# EAGLE design lixie_digit_maxi (EAGLE 7.6.0)
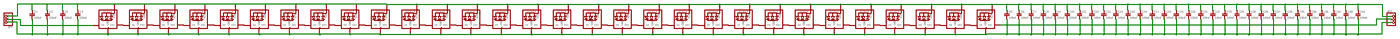
[diagram p0: schematic, sheet 1, overview]
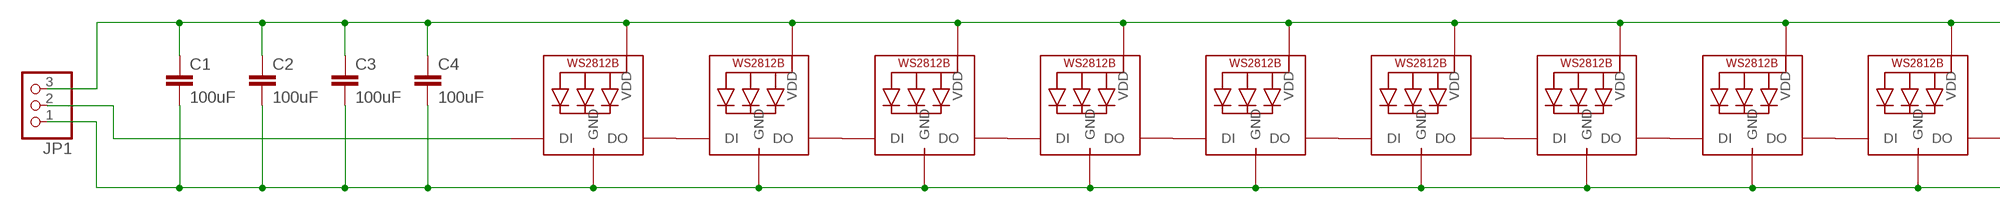
[diagram p1: schematic, sheet 1, part 1 of 4]
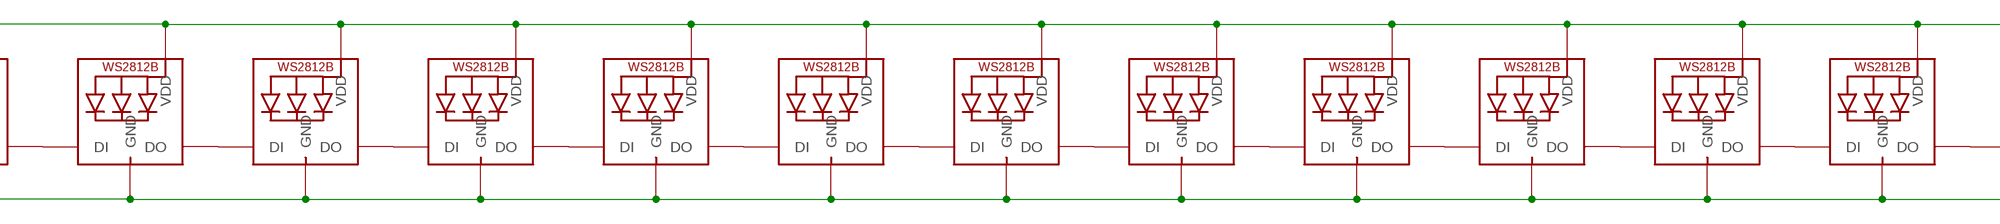
[diagram p2: schematic, sheet 1, part 2 of 4]
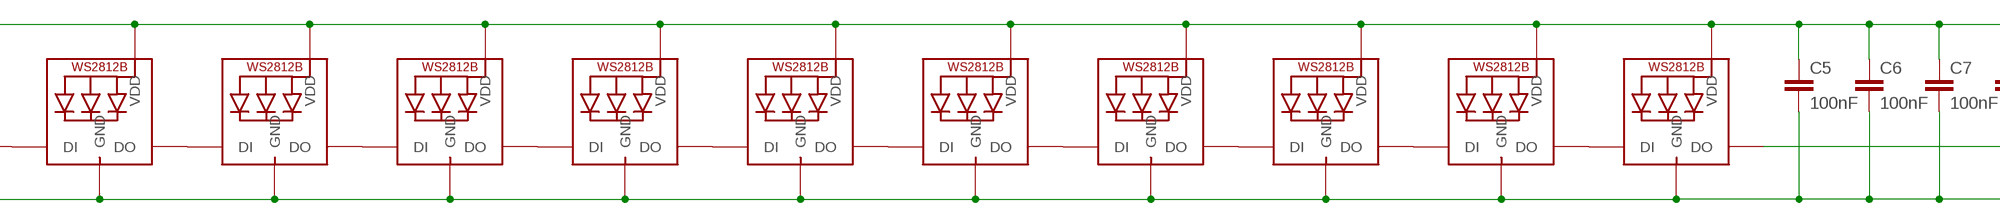
[diagram p3: schematic, sheet 1, part 3 of 4]
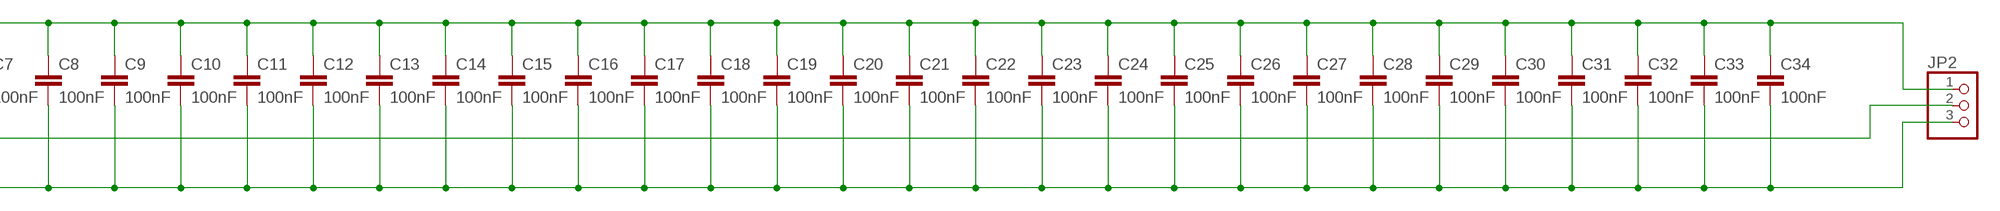
[diagram p4: schematic, sheet 1, part 4 of 4]

## Parts
C1  100uF  C-EUC1206K  [C1206K]
C2  100uF  C-EUC1206K  [C1206K]
C3  100uF  C-EUC1206K  [C1206K]
C4  100uF  C-EUC1206K  [C1206K]
C5  100nF  C-EUC0402K  [C0402K]
C6  100nF  C-EUC0402K  [C0402K]
C7  100nF  C-EUC0402K  [C0402K]
C8  100nF  C-EUC0402K  [C0402K]
C9  100nF  C-EUC0402K  [C0402K]
C10  100nF  C-EUC0402K  [C0402K]
C11  100nF  C-EUC0402K  [C0402K]
C12  100nF  C-EUC0402K  [C0402K]
C13  100nF  C-EUC0402K  [C0402K]
C14  100nF  C-EUC0402K  [C0402K]
C15  100nF  C-EUC0402K  [C0402K]
C16  100nF  C-EUC0402K  [C0402K]
C17  100nF  C-EUC0402K  [C0402K]
C18  100nF  C-EUC0402K  [C0402K]
C19  100nF  C-EUC0402K  [C0402K]
C20  100nF  C-EUC0402K  [C0402K]
C21  100nF  C-EUC0402K  [C0402K]
C22  100nF  C-EUC0402K  [C0402K]
C23  100nF  C-EUC0402K  [C0402K]
C24  100nF  C-EUC0402K  [C0402K]
C25  100nF  C-EUC0402K  [C0402K]
C26  100nF  C-EUC0402K  [C0402K]
C27  100nF  C-EUC0402K  [C0402K]
C28  100nF  C-EUC0402K  [C0402K]
C29  100nF  C-EUC0402K  [C0402K]
C30  100nF  C-EUC0402K  [C0402K]
C31  100nF  C-EUC0402K  [C0402K]
C32  100nF  C-EUC0402K  [C0402K]
C33  100nF  C-EUC0402K  [C0402K]
C34  100nF  C-EUC0402K  [C0402K]
JP1  PINHD-1X3  [1X03]
JP2  PINHD-1X3  [1X03]
LED1  WS2812B5050  [WS2812B]
LED2  WS2812B5050  [WS2812B]
LED3  WS2812B5050  [WS2812B]
LED4  WS2812B5050  [WS2812B]
LED5  WS2812B5050  [WS2812B]
LED6  WS2812B5050  [WS2812B]
LED7  WS2812B5050  [WS2812B]
LED8  WS2812B5050  [WS2812B]
LED9  WS2812B5050  [WS2812B]
LED10  WS2812B5050  [WS2812B]
LED11  WS2812B5050  [WS2812B]
LED12  WS2812B5050  [WS2812B]
LED13  WS2812B5050  [WS2812B]
LED14  WS2812B5050  [WS2812B]
LED15  WS2812B5050  [WS2812B]
LED16  WS2812B5050  [WS2812B]
LED17  WS2812B5050  [WS2812B]
LED18  WS2812B5050  [WS2812B]
LED19  WS2812B5050  [WS2812B]
LED20  WS2812B5050  [WS2812B]
LED21  WS2812B5050  [WS2812B]
LED22  WS2812B5050  [WS2812B]
LED23  WS2812B5050  [WS2812B]
LED24  WS2812B5050  [WS2812B]
LED25  WS2812B5050  [WS2812B]
LED26  WS2812B5050  [WS2812B]
LED27  WS2812B5050  [WS2812B]
LED28  WS2812B5050  [WS2812B]
LED29  WS2812B5050  [WS2812B]
LED30  WS2812B5050  [WS2812B]

## Nets
GND: C1.2 C2.2 C3.2 C4.2 C5.2 C6.2 C7.2 C8.2 C9.2 C10.2 C11.2 C12.2 C13.2 C14.2 C15.2 C16.2 C17.2 C18.2 C19.2 C20.2 C21.2 C22.2 C23.2 C24.2 C25.2 C26.2 C27.2 C28.2 C29.2 C30.2 C31.2 C32.2 C33.2 C34.2 JP1.1 JP2.3 LED1.3-GND(GND) LED2.3-GND(GND) LED3.3-GND(GND) LED4.3-GND(GND) LED5.3-GND(GND) LED6.3-GND(GND) LED7.3-GND(GND) LED8.3-GND(GND) LED9.3-GND(GND) LED10.3-GND(GND) LED11.3-GND(GND) LED12.3-GND(GND) LED13.3-GND(GND) LED14.3-GND(GND) LED15.3-GND(GND) LED16.3-GND(GND) LED17.3-GND(GND) LED18.3-GND(GND) LED19.3-GND(GND) LED20.3-GND(GND) LED21.3-GND(GND) LED22.3-GND(GND) LED23.3-GND(GND) LED24.3-GND(GND) LED25.3-GND(GND) LED26.3-GND(GND) LED27.3-GND(GND) LED28.3-GND(GND) LED29.3-GND(GND) LED30.3-GND(GND)
N$1: LED11.2-DOUT(DO) LED12.4-DIN(DI)
N$2: LED12.2-DOUT(DO) LED13.4-DIN(DI)
N$3: LED13.2-DOUT(DO) LED14.4-DIN(DI)
N$4: LED14.2-DOUT(DO) LED15.4-DIN(DI)
N$5: LED15.2-DOUT(DO) LED16.4-DIN(DI)
N$6: LED16.2-DOUT(DO) LED17.4-DIN(DI)
N$7: LED17.2-DOUT(DO) LED18.4-DIN(DI)
N$8: LED18.2-DOUT(DO) LED19.4-DIN(DI)
N$9: LED19.2-DOUT(DO) LED20.4-DIN(DI)
N$10: LED20.2-DOUT(DO) LED21.4-DIN(DI)
N$11: LED21.2-DOUT(DO) LED22.4-DIN(DI)
N$12: LED22.2-DOUT(DO) LED23.4-DIN(DI)
N$13: LED23.2-DOUT(DO) LED24.4-DIN(DI)
N$14: LED24.2-DOUT(DO) LED25.4-DIN(DI)
N$15: LED25.2-DOUT(DO) LED26.4-DIN(DI)
N$16: LED26.2-DOUT(DO) LED27.4-DIN(DI)
N$17: LED27.2-DOUT(DO) LED28.4-DIN(DI)
N$18: LED28.2-DOUT(DO) LED29.4-DIN(DI)
N$19: LED29.2-DOUT(DO) LED30.4-DIN(DI)
N$21: LED10.2-DOUT(DO) LED11.4-DIN(DI)
N$22: LED7.2-DOUT(DO) LED8.4-DIN(DI)
N$23: LED6.2-DOUT(DO) LED7.4-DIN(DI)
N$24: JP2.2 LED30.2-DOUT(DO)
N$25: LED5.2-DOUT(DO) LED6.4-DIN(DI)
N$26: LED3.2-DOUT(DO) LED4.4-DIN(DI)
N$27: LED2.2-DOUT(DO) LED3.4-DIN(DI)
N$28: LED1.2-DOUT(DO) LED2.4-DIN(DI)
N$29: LED4.2-DOUT(DO) LED5.4-DIN(DI)
N$30: LED8.2-DOUT(DO) LED9.4-DIN(DI)
N$31: LED9.2-DOUT(DO) LED10.4-DIN(DI)
N$32: JP1.2 LED1.4-DIN(DI)
VCC: C1.1 C2.1 C3.1 C4.1 C5.1 C6.1 C7.1 C8.1 C9.1 C10.1 C11.1 C12.1 C13.1 C14.1 C15.1 C16.1 C17.1 C18.1 C19.1 C20.1 C21.1 C22.1 C23.1 C24.1 C25.1 C26.1 C27.1 C28.1 C29.1 C30.1 C31.1 C32.1 C33.1 C34.1 JP1.3 JP2.1 LED1.1-VDD(VDD) LED2.1-VDD(VDD) LED3.1-VDD(VDD) LED4.1-VDD(VDD) LED5.1-VDD(VDD) LED6.1-VDD(VDD) LED7.1-VDD(VDD) LED8.1-VDD(VDD) LED9.1-VDD(VDD) LED10.1-VDD(VDD) LED11.1-VDD(VDD) LED12.1-VDD(VDD) LED13.1-VDD(VDD) LED14.1-VDD(VDD) LED15.1-VDD(VDD) LED16.1-VDD(VDD) LED17.1-VDD(VDD) LED18.1-VDD(VDD) LED19.1-VDD(VDD) LED20.1-VDD(VDD) LED21.1-VDD(VDD) LED22.1-VDD(VDD) LED23.1-VDD(VDD) LED24.1-VDD(VDD) LED25.1-VDD(VDD) LED26.1-VDD(VDD) LED27.1-VDD(VDD) LED28.1-VDD(VDD) LED29.1-VDD(VDD) LED30.1-VDD(VDD)

## Library data of the parts
C1-C34 = rcl:C-EU: CAPACITOR, European symbol
JP1 JP2 = adafruit:PINHD-1X3: PIN HEADER
LED1-LED30 = adafruit:WS2812B

## Board
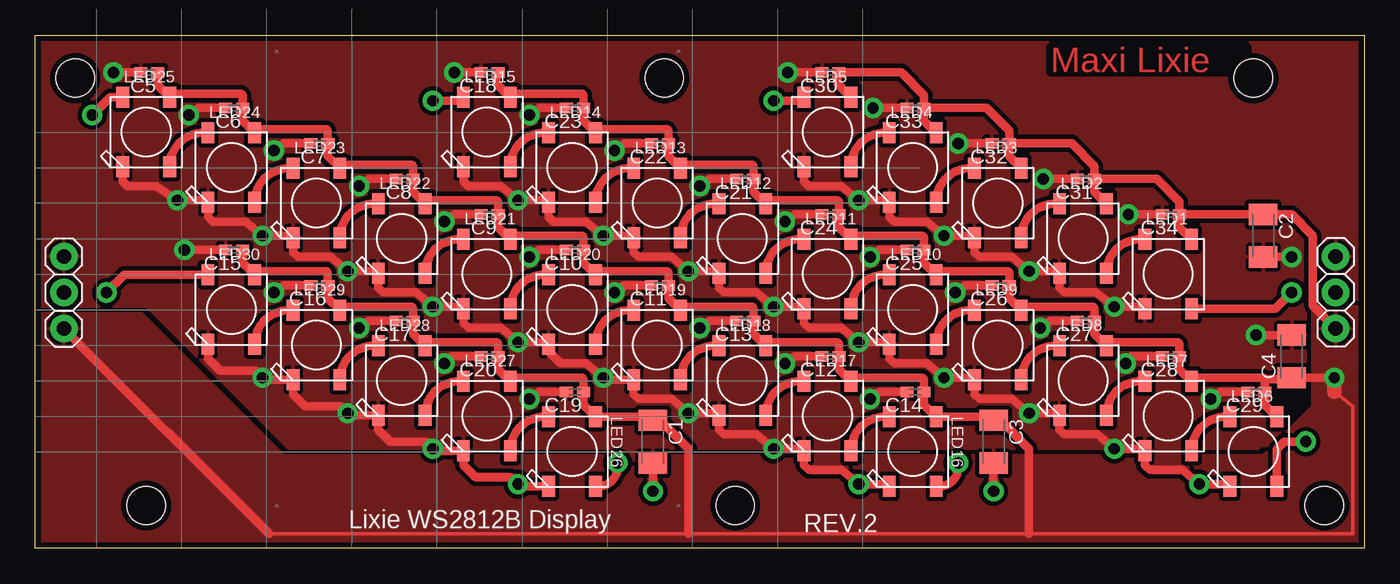
[diagram p5: board, top side]
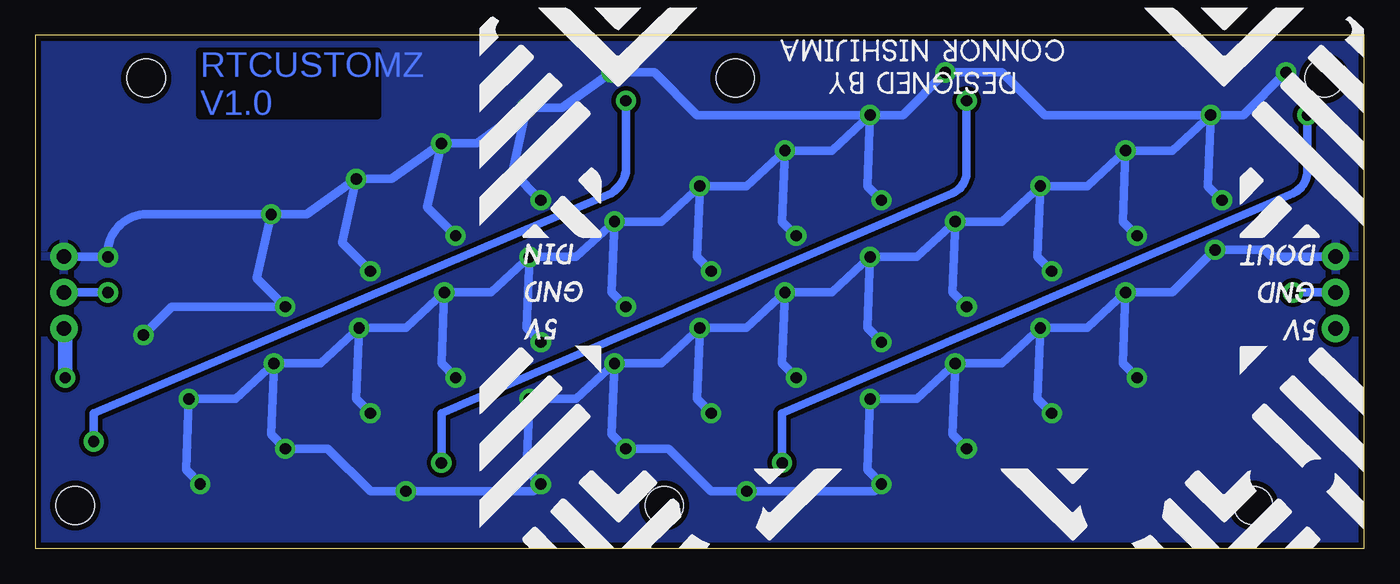
[diagram p6: board, bottom side, seen from below]

Size 93.6 x 36.1 mm. Coordinates in mm from the lower left corner, seen from the top.
Outline: 0,0 0,36.1 93.6,36.1 93.6,0 0,0
Copper layers (1*16): Top 0.035mm / dielectric 1.6mm / Bottom 0.035mm
Design rules "Elecrow_2-layer_PCB_eagle_rule *": minimum track width 6mil, minimum drill 12mil, track to track 12mil, track to pad 12mil, pad to pad 12mil, via to via 12mil, smd to smd 0mil, copper to edge 16mil, drill to drill 10mil, minimum pad ring 6mil, minimum via ring 6mil, stop-mask expansion 0mil, vias tented up to drill 100mil, thermal gap 10mil
Holes 2.7 mm at 2.8,33.1 85.8,33.1 90.8,3 7.8,3 44.3,33.1 49.3,3

### Footprints (pad centres in the part's own frame; a part is rotated, then mirrored left to right if it is on the bottom)
C1206K = smd 1.5 x 2: 1 -1.5,0; 2 1.5,0
C0402K = smd 0.925 x 0.74: 1 -0.6,0; 2 0.6,0
1X03 = drill 1.016 pad 1.93: 1 -2.54,0; 2 0,0; 3 2.54,0
WS2812B = smd 1.5 x 0.9: 1-VDD 2.45,-1.65; 2-DOUT 2.45,1.65; 3-GND -2.45,1.65; 4-DIN -2.45,-1.65

### Placement (x,y rotation side)
C1  43.5,7.5 270 top
C2  86.5,22 270 top
C3  67.5,7.5 270 top
C4  88.5,13.5 90 top
C5  8,33.5 180 top
C6  14,31 180 top
C7  20,28.5 180 top
C8  26,26 180 top
C9  32,23.5 180 top
C10  38,21 180 top
C11  44,18.5 180 top
C12  56,13.5 180 top
C13  50,16 180 top
C14  62,11 180 top
C15  14,21 180 top
C16  20,18.5 180 top
C17  26,16 180 top
C18  32,33.5 180 top
C19  38,11 180 top
C20  32,13.5 180 top
C21  50,26 180 top
C22  44,28.5 180 top
C23  38,31 180 top
C24  56,23.5 180 top
C25  62,21 180 top
C26  68,18.5 180 top
C27  74,16 180 top
C28  80,13.5 180 top
C29  86,11 180 top
C30  56,33.5 180 top
C31  74,26 180 top
C32  68,28.5 180 top
C33  62,31 180 top
C34  80,23.5 180 top
JP1  91.6,18 270 top
JP2  2,18 90 top
LED1  79.8,19.3 90 top
LED2  73.8,21.8 90 top
LED3  67.8,24.3 90 top
LED4  61.8,26.8 90 top
LED5  55.8,29.3 90 top
LED6  85.8,6.8 90 top
LED7  79.8,9.3 90 top
LED8  73.8,11.8 90 top
LED9  67.8,14.3 90 top
LED10  61.8,16.8 90 top
LED11  55.8,19.3 90 top
LED12  49.8,21.8 90 top
LED13  43.8,24.3 90 top
LED14  37.8,26.8 90 top
LED15  31.8,29.3 90 top
LED16  61.8,6.8 90 top
LED17  55.8,9.3 90 top
LED18  49.8,11.8 90 top
LED19  43.8,14.3 90 top
LED20  37.8,16.8 90 top
LED21  31.8,19.3 90 top
LED22  25.8,21.8 90 top
LED23  19.8,24.3 90 top
LED24  13.8,26.8 90 top
LED25  7.8,29.3 90 top
LED26  37.8,6.8 90 top
LED27  31.8,9.3 90 top
LED28  25.8,11.8 90 top
LED29  19.8,14.3 90 top
LED30  13.8,16.8 90 top

### Tracks (layer width: path | path; a pad name or v marks a point on that pad's centre or on a via)
GND  (via drill 0.8 pad 1.42)
  Top 0.61: LED26.3-GND 34.15,4.35 33.5,5 31,5 30.15,5.85 LED27.3-GND 28.15,6.85 27.5,7.5 25,7.5 24.15,8.35 LED28.3-GND 22.15,9.35 21.5,10 19,10 18.15,10.85 LED29.3-GND 16.15,11.85 15.5,12.5 13,12.5 12.15,13.35 LED30.3-GND | LED16.3-GND 60,4.5 v58,4.5 56.8,5.5 54.5,5.5 54.15,5.85 LED17.3-GND 54,7 v52,7 50.8,8 48.5,8 48.15,8.35 LED18.3-GND 48,9.5 v46,9.5 44.8,10.5 42.5,10.5 42.15,10.85 LED19.3-GND 40.15,11.85 38.8,13 37,13 36.15,13.85 LED20.3-GND 36,14.5 v34,14.5 32.8,15.5 30.5,15.5 30.15,15.85 LED21.3-GND 30,17 v28,17 26.8,18 24.5,18 24.15,18.35 LED22.3-GND 24,19.5 v22,19.5 20.8,20.5 18.5,20.5 18.15,20.85 LED23.3-GND 18,22 v16,22 14.8,23 12.5,23 12.15,23.35 LED24.3-GND 12,24.5 v10,24.5 8.5,25.5 6.5,25.5 6.15,25.85 LED25.3-GND | LED15.3-GND 30.15,25.85 30.5,25.5 32.8,25.5 v34,24.5 36,24.5 LED14.3-GND 36.15,23.35 36.5,23 38.8,23 v40,22 42,22 LED13.3-GND 42.15,20.85 42.5,20.5 44.8,20.5 v46,19.5 48,19.5 LED12.3-GND 48.15,18.35 48.5,18 50.8,18 v52,17 54,17 LED11.3-GND 54.15,15.85 54.5,15.5 56.8,15.5 v58,14.5 60,14.5 LED10.3-GND 60.15,13.35 60.5,13 62.8,13 v64,12 66,12 LED9.3-GND 66.15,10.85 66.5,10.5 68.8,10.5 v70,9.5 72,9.5 LED8.3-GND 72.15,8.35 72.5,8 74.8,8 v76,7 78,7 LED7.3-GND 78.15,5.85 78.5,5.5 80.8,5.5 v82,4.5 84,4.5 LED6.3-GND | LED5.3-GND 54.15,25.85 54.5,25.5 56.8,25.5 v58,24.5 60,24.5 LED4.3-GND 60.15,23.35 60.5,23 62.8,23 v64,22 66,22 LED3.3-GND 66.15,20.85 66.5,20.5 68.8,20.5 v70,19.5 72,19.5 LED2.3-GND 72.15,18.35 72.5,18 74.7,18 v76,17 78,17 LED1.3-GND | v88.5,20.5 C2.2 | C34.2 v77,23.5 | C31.2 v71,26
  Top 0.61: v65,28.5 C32.2 | C33.2 v59,31 | v53,33.5 C30.2 | C29.2 83.5,11 v82.8,10.5 | v29.5,33.5 C18.2 | C23.2 35.5,31 v34.8,30.5 | C22.2 41.5,28.5 v40.8,28 | C21.2 47.5,26 v46.8,25.5 | C24.2 53.5,23.5 v52.8,23 | C25.2 59.5,21 v58.8,20.5 | C26.2 65.5,18.5 v64.8,18 | C27.2 71.5,16 v70.8,15.5 | C28.2 77.2,13.5 v76.8,13 | C14.2 59.5,11 v58.8,10.5 | v52.8,13 53.5,13.5 C12.2 | C13.2 47.5,16 v46.8,15.5 | C11.2 41.5,18.5 v40.8,18 | C10.2 35.5,21 v34.8,20.5 | C9.2 29.5,23.5 v28.8,23 | C8.2 23.5,26 v22.8,25.5 | C7.2 17.5,28.5 v16.8,28 | C6.2 11.5,31 v10.8,30.5 | C5.2 v5.5,33.5 | C19.2 35.5,11 v34.8,10.5 | v28.8,13 29.3,13.5 C20.2 | C17.2 23.5,16 v22.8,15.5 | C16.2 17.5,18.5 v16.8,18 | C15.2 v10.5,21 | C1.2 v43.5,4 | C3.2 v67.5,4 | C4.2 v86,15
  Bottom 0.61: JP1.1 91.56,20.5 v88.5,20.5 arc90 86,23.5 v77,23.5 | v76.8,13 79.5,10.5 v82.8,10.5 83,5.5 v82,4.5 | v76.8,13 73.5,13 v70.8,15.5 | v70.8,15.5 67.5,15.5 v64.8,18 | v64.8,18 61.5,18 v58.8,20.5 | v58.8,20.5 55.5,20.5 v52.8,23 | v52.8,23 49.5,23 v46.8,25.5 | v46.8,25.5 43.5,25.5 v40.8,28 | v40.8,28 37.5,28 v34.8,30.5 | v34.8,30.5 32.5,30.5 v29.5,33.5 25.5,33.5 22.5,30.5 11.5,30.5 | v52.8,13 55.5,10.5 v58.8,10.5 59,5.5 v58,4.5 58.5,4 v67.5,4 70,4 73,7 v76,7 77,8 v76.8,13 | v46.8,15.5 49.5,13 v52.8,13 | v40.8,18 43.5,15.5 v46.8,15.5 | v34.8,20.5 37.5,18 v40.8,18 | v28.8,23 31.5,20.5 v34.8,20.5 | v22.8,25.5 25.5,23 v28.8,23 | v16.8,28 19.5,25.5 v22.8,25.5 | v10.8,30.5 13.5,28 v16.8,28 | v5.5,33.5 8.5,30.5 v10.8,30.5 | v28.8,13 31.5,10.5 v34.8,10.5 35,5.5 v34,4.5 34.5,4 v43.5,4 46,4 49,7 v52,7 53,8 v52.8,13 | v22.8,15.5 25.5,13 v28.8,13 | v16.8,18 19.5,15.5 v22.8,15.5 | v16.8,18 13.5,18 v10.5,21 7,21 6.5,20.5 2.04,20.5 JP2.3 | v59,31 56.5,31 v53,33.5 50,33.5 47,30.5 v34.8,30.5 | v59,31 62.5,28.5 v65,28.5 | v65,28.5 68.5,26 v71,26 | v71,26 74.5,23.5 v77,23.5 | v28,7 29,8 v28.8,13 | v22,9.5 23,10.5 v22.8,15.5 | v16,12 17,13 v16.8,18 | v10,24.5 11,25.5 v10.8,30.5 | v16,22 17,23 v16.8,28 | v22,19.5 23,20.5 v22.8,25.5 | v28,17 29,18 v28.8,23 | v34,14.5 35,15.5 v34.8,20.5 | v40,12 41,13 v40.8,18 | v46,9.5 47,10.5 v46.8,15.5 | v34,24.5 35,25.5 v34.8,30.5 | v40,22 41,23 v40.8,28 | v46,19.5 47,20.5 v46.8,25.5 | v52,17 53,18 v52.8,23 | v58,14.5 59,15.5 v58.8,20.5 | v64,12 65,13 v64.8,18 | v70,9.5 71,10.5 v70.8,15.5 | v58,24.5 60,26.5 v59,31 | v64,22 66,24 v65,28.5 | v70,19.5 72,21.5 v71,26 | v76,17 78,19 v77,23.5 | v86,15 84,17 76.5,17
  pour Top (rank 2): 95.5,3 0,2.5 0,36.5 95.5,37
  pour Bottom: -1.5,37.5 96,37.5 95.5,-2 -2,-2
N$1
  Top 0.61: LED11.2-DOUT 53.85,21.75 arc90 LED12.4-DIN
N$2
  Top 0.61: LED12.2-DOUT 47.85,24.25 arc90 LED13.4-DIN
N$3
  Top 0.61: LED13.2-DOUT 41.85,26.75 arc90 LED14.4-DIN
N$4
  Top 0.61: LED14.2-DOUT 35.85,29.25 arc90 LED15.4-DIN
N$5  (via drill 0.8 pad 1.42)
  Top 0.61: LED15.2-DOUT 29.9,31.5 v28,31.5 | v65,6 arc-90 63.85,4.35 LED16.4-DIN
  Bottom 0.61: v28,31.5 28,26.5 arc67 29,25 65,9.5 v65,6
N$6
  Top 0.61: LED16.2-DOUT 59.85,9.25 arc90 LED17.4-DIN
N$7
  Top 0.61: LED17.2-DOUT 53.85,11.75 arc90 LED18.4-DIN
N$8
  Top 0.61: LED18.2-DOUT 47.85,14.25 arc90 LED19.4-DIN
N$9
  Top 0.61: LED19.2-DOUT 41.85,16.75 arc90 LED20.4-DIN
N$10
  Top 0.61: LED20.2-DOUT 35.85,19.25 arc90 LED21.4-DIN
N$11
  Top 0.61: LED21.2-DOUT 29.85,21.75 arc90 LED22.4-DIN
N$12
  Top 0.61: LED22.2-DOUT 23.85,24.25 arc90 LED23.4-DIN
N$13
  Top 0.61: LED23.2-DOUT 17.85,26.75 arc90 LED24.4-DIN
N$14
  Top 0.61: LED24.2-DOUT 11.85,29.25 arc90 LED25.4-DIN
N$15  (via drill 0.8 pad 1.42)
  Top 0.61: LED25.2-DOUT 5.25,31.75 v4,30.5 | v41,6 arc-90 39.85,4.35 LED26.4-DIN
  Bottom 0.61: v4,30.5 4,26.5 arc67 5,25 41,9.5 v41,6
N$16
  Top 0.61: LED26.2-DOUT 35.85,9.25 arc90 LED27.4-DIN
N$17
  Top 0.61: LED27.2-DOUT 29.85,11.75 arc90 LED28.4-DIN
N$18
  Top 0.61: LED28.2-DOUT 23.85,14.25 arc90 LED29.4-DIN
N$19
  Top 0.61: LED29.2-DOUT 17.85,16.75 arc90 LED30.4-DIN
N$21
  Top 0.61: LED10.2-DOUT 59.85,19.25 arc90 LED11.4-DIN
N$22
  Top 0.61: LED7.2-DOUT 77.85,11.75 arc90 LED8.4-DIN
N$23
  Top 0.61: LED6.2-DOUT 83.85,9.25 arc90 LED7.4-DIN
N$24  (via drill 0.8 pad 1.42)
  Top 0.61: v5,18 6.25,19.25 LED30.2-DOUT
  Bottom 0.61: JP2.2 v5,18
N$25  (via drill 0.8 pad 1.42)
  Top 0.61: LED5.2-DOUT 54.15,31.5 v52,31.5 | LED6.4-DIN 87.45,6.95 88,7.5 v89.5,7.5
  Bottom 0.61: v52,31.5 52,26.5 arc44 53,25 89.5,9.5 v89.5,7.5
N$26
  Top 0.61: LED3.2-DOUT 65.85,26.75 arc90 LED4.4-DIN
N$27
  Top 0.61: LED2.2-DOUT 71.85,24.25 arc90 LED3.4-DIN
N$28
  Top 0.61: LED1.2-DOUT 77.85,21.75 arc90 LED2.4-DIN
N$29
  Top 0.61: LED4.2-DOUT 59.85,29.25 arc90 LED5.4-DIN
N$30
  Top 0.61: LED8.2-DOUT 71.85,14.25 arc90 LED9.4-DIN
N$31
  Top 0.61: LED9.2-DOUT 65.85,16.75 arc90 LED10.4-DIN
N$32  (via drill 0.8 pad 1.42)
  Top 0.61: v88.5,18 87.35,16.85 LED1.4-DIN
  Bottom 0.61: JP1.2 v88.5,18
VCC  (via drill 0.8 pad 1.42)
  Top 0.254: 91.5,11 92.8,10 92.8,1 70,1 46,1 16.46,1
  Top 0.61: C34.1 80.6,22.6 LED1.1-VDD | C31.1 74.6,25.1 LED2.1-VDD | C32.1 68.6,27.6 LED3.1-VDD | C33.1 62.6,30.1 LED4.1-VDD | LED5.1-VDD 56.5,32.7 56.5,33.5 C30.1 61,33.5 62.6,31.9 C33.1 | C15.1 14.6,20.1 LED30.1-VDD 15.7,19.5 20.5,19.5 20.6,19.4 C16.1 20.6,17.6 LED29.1-VDD 21.7,17 26.5,17 26.6,16.9 C17.1 26.6,15.1 LED28.1-VDD 27.7,14.5 32.5,14.5 32.6,14.4 C20.1 32.6,12.6 LED27.1-VDD 33.7,12 38.5,12 38.6,11.9 C19.1 38.6,10.1 LED26.1-VDD 43.25,9.25 arc-90 C1.1 44,9 46,7 46,1 | C5.1 8.6,32.6 LED25.1-VDD 9.7,32 14.5,32 14.6,31.9 C6.1 14.6,30.1 LED24.1-VDD 15.7,29.5 20.5,29.5 20.6,29.4 C7.1 20.6,27.6 21.2,27 | 21.2,27 LED23.1-VDD | C18.1 32.5,33.5 32.5,32.7 LED15.1-VDD 33.7,32 38.5,32 38.6,31.9 C23.1 38.6,30.1 LED14.1-VDD 39.7,29.5 44.5,29.5 44.6,29.4 C22.1 44.6,27.6 LED13.1-VDD 45.7,27 50.5,27 50.6,26.9 C21.1 50.6,25.1 LED12.1-VDD 51.7,24.5 56.5,24.5 56.6,24.4 C24.1 56.6,22.6 LED11.1-VDD 57.7,22 62.5,22 62.6,21.9 C25.1 62.6,20.1 LED10.1-VDD 63.7,19.5 68.5,19.5 68.6,19.4 C26.1 68.6,17.6 69.2,17 | 51.2,14.5 50.6,15.1 C13.1 50.6,16.9 50.5,17 45.7,17 LED19.1-VDD 44.6,17.6 C11.1 44.6,19.4 44.5,19.5 39.7,19.5 LED20.1-VDD 38.6,20.1 C10.1 38.6,21.9 38.5,22 33.7,22 LED21.1-VDD 32.6,22.6 C9.1 32.6,24.4 32.5,24.5 27.7,24.5 LED22.1-VDD 26.6,25.1 C8.1 26.6,26.9 26.5,27 21.2,27 | 51.2,14.5 LED18.1-VDD | 69.2,17 LED9.1-VDD | LED6.1-VDD 86.6,10.1 C29.1 86.6,11.9 | C34.1 80.6,24.4 79,26 C31.1 | C31.1 74.6,26.9 73,28.5 C32.1 | C32.1 68.6,29.4 67,31 C33.1 | 86.6,11.9 86.5,12 81.7,12 LED7.1-VDD 80.6,12.6 C28.1 80.6,14.4 80.5,14.5 75.7,14.5 LED8.1-VDD 74.6,15.1 C27.1 74.6,16.9 74.5,17 69.2,17
  Top 0.61: 51.2,14.5 56.5,14.5 56.6,14.4 C12.1 56.6,12.6 LED17.1-VDD 57.7,12 62.5,12 62.6,11.9 C14.1 62.6,10.1 LED16.1-VDD 67.25,9.25 arc-90 C3.1 68,9 70,7 70,1 | C34.1 C2.1 88.5,23.5 90,22 90,17.06 JP1.3 | 86.6,11.9 88.4,11.9 C4.1 v91.5,12 | JP2.1 16.46,1
  Top 1.016: 91.5,11 v91.5,12
  Bottom 0.61: JP1.3 91.5,15.36
  Bottom 1.016: 91.5,15.36 v91.5,12
  pour Top: -1,16.5 7.5,16.5 17.5,6.5 86.5,6.5 90,10 90,17 95,17 95,-1 -1,-1

### Text on the board
Top: Maxi Lixie
Bottom: RTCUSTOMZ / V1.0
tNames: REV.2 | Lixie WS2812B Display
tDocu: Lixie Display PCB | Revision 2 | Layout by Connor Nishijima | Last Updated: / December 16th, 2016 | Released under the GPLv3 License | [OSHW] US000054